# EAGLE design ATTINY85-USB (EAGLE 7.1.0)
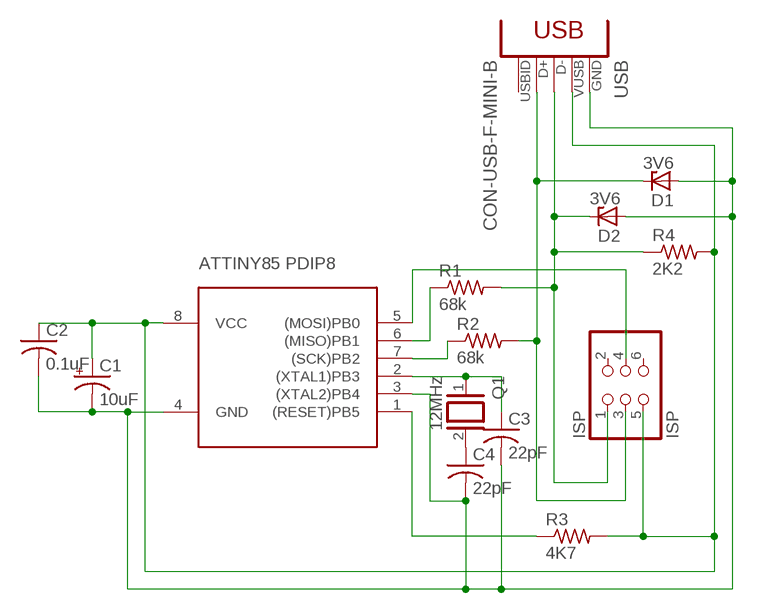
[diagram p0: schematic, sheet 1]

## Parts
C1  10uF  CPOL-USE2-4  [E2-4]
C2  0.1uF  C-US025-024X044  [C025-024X044]
C3  22pF  C-US025-024X044  [C025-024X044]
C4  22pF  C-US025-024X044  [C025-024X044]
D1  3V6  ZENER-DIODEDO34-7  [DO34Z7]
D2  3V6  ZENER-DIODEDO34-7  [DO34Z7]
IC1  TINY85  ATTINY85-PDIP8  [DIL08]
ISP  ISP  PINHD-2X3  [2X03]
Q1  12MHz  XTAL/S  [QS]
R1  68k  R-US_0207/9  [0207/9]
R2  68k  R-US_0207/9  [0207/9]
R3  4K7  R-US_0207/9  [0207/9]
R4  2K2  R-US_0207/9  [0207/9]
USB  CON-USB-F-MINI-B  [CONN_USB_MINI-B]

## Nets
N$1: IC1.6((MISO)PB1) R1.1
N$2: D2.C ISP.1 R1.2 R4.1 USB.D-
N$3: D1.C ISP.3 R2.2 USB.D+
N$4: IC1.5((MOSI)PB0) ISP.4
N$5: IC1.1((RESET)PB5) R3.1
N$6: C4.1 Q1.2
N$8: C3.1 IC1.2((XTAL1)PB3) Q1.1
N$9: C1.+ C2.1 IC1.8(VCC) ISP.5 R3.2 R4.2 USB.VUSB
N$10: IC1.7((SCK)PB2) R2.1
N$11: C1.- C2.2 C3.2 C4.2 D1.A D2.A IC1.3((XTAL2)PB4) IC1.4(GND) USB.GND
Unconnected: ISP.2 ISP.6 USB.BODY@1(BODY) USB.BODY@2(BODY) USB.BODY@3(BODY) USB.BODY@4(BODY) USB.ID(USBID)

## Library data of the parts
C1 = adafruit:CPOL-US: POLARIZED CAPACITOR, American symbol
C2-C4 = adafruit:C-US: CAPACITOR, American symbol
D1 D2 = diode:ZENER-DIODE: Z-Diode
IC1 = modal:ATTINY85-PDIP8
ISP = pinhead:PINHD-2X3: PIN HEADER
Q1 = special:XTAL/S: CRYSTAL
R1-R4 = adafruit:R-US_: RESISTOR, American symbol
USB = dp_devices:CON-USB-F: USB Female connector

## Board
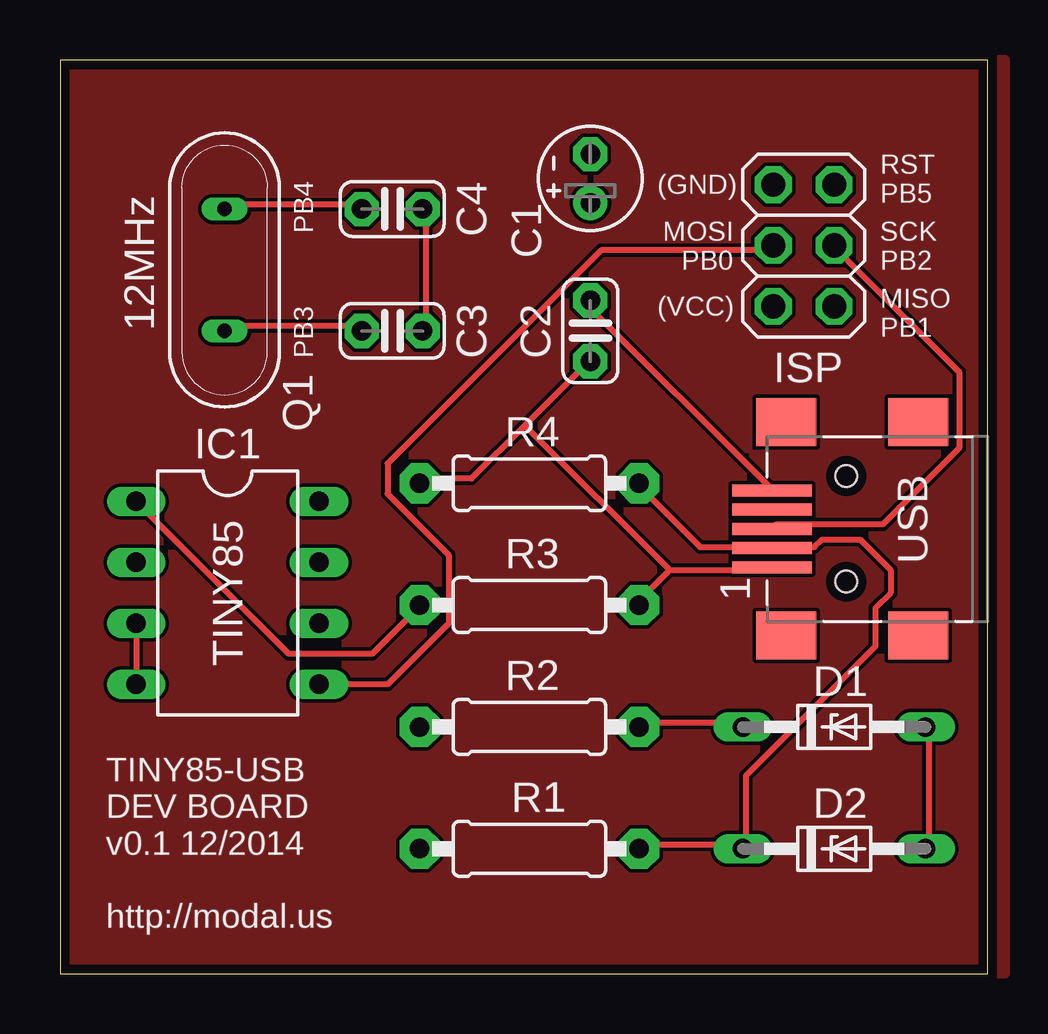
[diagram p1: board, top side]
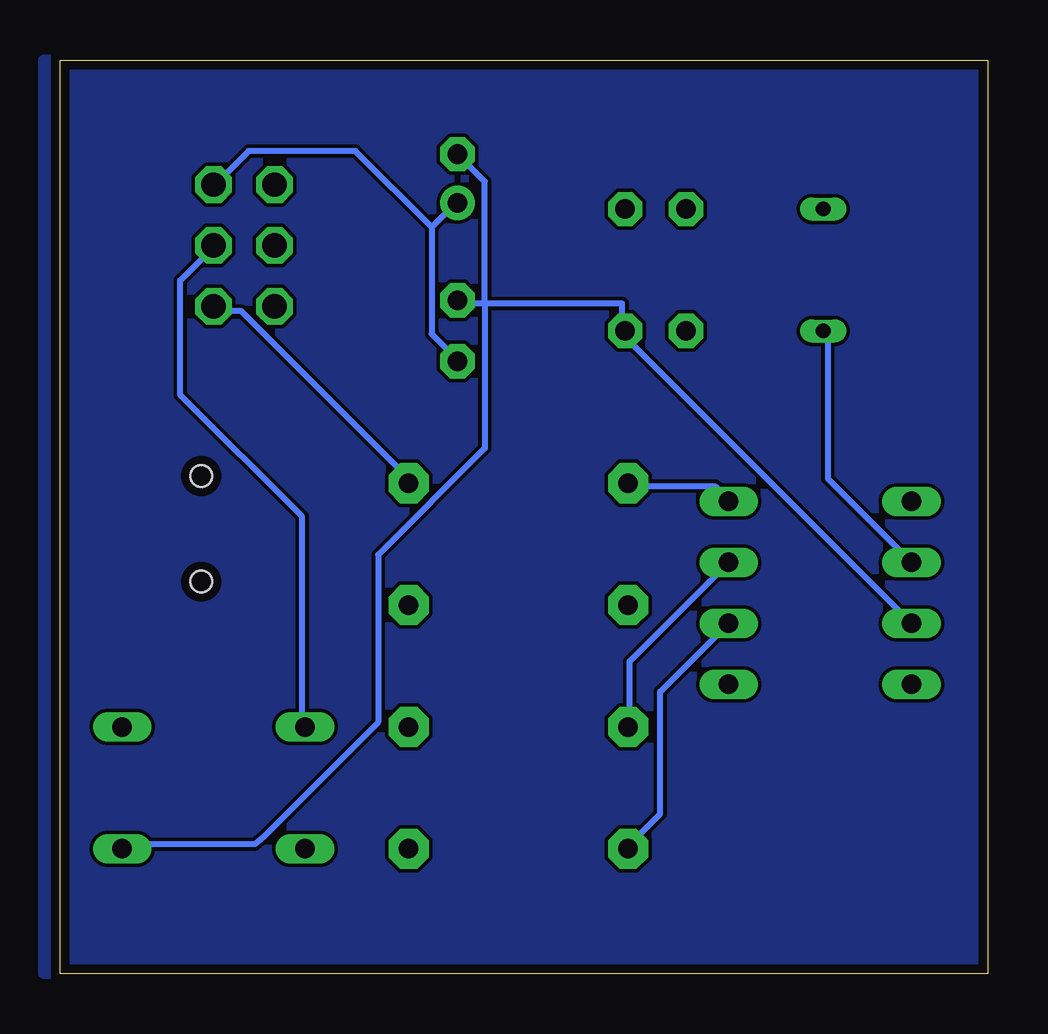
[diagram p2: board, bottom side, seen from below]

Size 38.66 x 38.09 mm. Coordinates in mm from the lower left corner, seen from the top.
Outline: 0,0 38.66,0 38.66,38.09 0,38.09 0,0
Copper layers (1*16): Top 0.0356mm / dielectric 1.5011mm / Bottom 0.0356mm
Design rules "LaenPCBOrder": minimum track width 6mil, minimum drill 13mil, track to track 6mil, track to pad 6mil, pad to pad 6mil, via to via 6mil, smd to smd 6mil, copper to edge 15mil, drill to drill 6mil, minimum pad ring 7mil, minimum via ring 7mil, stop-mask expansion 3mil, vias tented up to drill 0mil, thermal gap 10mil

### Footprints (pad centres in the part's own frame; a part is rotated, then mirrored left to right if it is on the bottom)
E2-4 = drill 0.813 pad 1.422: + -1.016,0 | drill 0.813 pad 1.422 octagon: - 1.016,0
C025-024X044 = drill 0.813 pad 1.422 octagon: 1 -1.27,0; 2 1.27,0
DO34Z7 = drill 0.813 long: A 3.81,0; C -3.81,0
DIL08 = drill 0.813 long: 1 -3.81,-3.81; 2 -1.27,-3.81; 3 1.27,-3.81; 4 3.81,-3.81; 5 3.81,3.81; 6 1.27,3.81; 7 -1.27,3.81; 8 -3.81,3.81
2X03 = drill 1.016 octagon: 1 -2.54,-1.27; 2 -2.54,1.27; 3 0,-1.27; 4 0,1.27; 5 2.54,-1.27; 6 2.54,1.27
QS = drill 0.61 long: 1 -2.54,0; 2 2.54,0
0207/9 = drill 0.813 pad 1.676 octagon: 1 -4.572,0; 2 4.572,0
CONN_USB_MINI-B = smd 2 x 2.5: BODY@1 -4.45,2.5; BODY@2 4.45,2.5; BODY@3 4.45,-3; BODY@4 -4.45,-3 | smd 0.5 x 3.3: D+ 0,3.1; D- -0.8,3.1; GND 1.6,3.1; ID 0.8,3.1; VUSB -1.6,3.1 | hole 0.9: -2.2,0; 2.2,0

### Placement (x,y rotation side)
C1  22.1,33.15 90 top
C2  22.1,26.8 90 top
C3  13.84,26.8 0 top
C4  13.84,31.88 0 top
D1  32.26,10.29 0 top
D2  32.26,5.21 0 top
IC1  6.99,15.88 270 top
ISP  30.99,30.35 90 top
Q1  6.86,29.34 90 top
R1  19.56,5.21 0 top
R2  19.56,10.29 0 top
R3  19.56,15.37 0 top
R4  19.56,20.45 180 top
USB  32.77,18.54 90 top

### Tracks (layer width: path | path; a pad name or v marks a point on that pad's centre or on a via)
N$1
  Bottom 0.254: IC1.6 13.65,11.75 13.65,6.67 14.92,5.4 R1.1
N$2
  Top 0.254: R1.2 24.13,5.4 28.26,5.4 D2.C 28.57,5.4 28.57,8.26 33.97,13.65 33.97,15.24 34.61,15.88 34.61,16.83 33.34,18.1 31.75,18.1 31.43,17.78 29.84,17.78 USB.D- 29.53,17.78 26.67,17.78 24.13,20.32 R4.1
  Bottom 0.254: ISP.1 32.07,27.62 31.11,27.62 24.13,20.64 R4.1
N$3
  Top 0.254: D1.C 28.26,10.48 24.13,10.48 R2.2 | USB.D+ 29.84,18.73 34.29,18.73 37.47,21.91 37.47,25.08 32.38,30.16 ISP.3
  Bottom 0.254: ISP.3 32.38,30.16 33.66,28.89 33.66,24.13 28.57,19.05 28.57,10.48 D1.C
N$4
  Top 0.254: IC1.5 13.65,12.06 16.19,14.61 16.19,17.46 13.65,20 13.65,21.27 22.54,30.16 29.53,30.16 ISP.4
N$5
  Top 0.254: IC1.1 9.53,13.34 13.02,13.34 14.92,15.24 R3.1
N$6
  Top 0.254: Q1.2 6.99,32.07 12.38,32.07 C4.1
N$7
  pour Top: 0,38.1 39.37,38.1 39.37,0 0,0 0,1.27
N$8
  Top 0.254: Q1.1 6.99,26.99 12.38,26.99 C3.1
  Bottom 0.254: IC1.2 6.67,20.64 6.67,26.67 Q1.1
N$9
  Top 0.254: 25.4,16.83 29.53,16.83 USB.VUSB | 25.4,16.83 24.13,15.56 R3.2 | 19.37,22.86 21.91,25.4 C2.1 | 19.37,22.86 17.14,20.64 15.24,20.64 R4.2 | 19.37,22.86 25.4,16.83
  Bottom 0.254: IC1.8 11.37,20.32 14.92,20.32 R4.2 | 23.18,31.11 23.18,26.67 22.23,25.72 C2.1 | 23.18,31.11 22.23,32.07 C1.+ | 23.18,31.11 26.35,34.29 30.8,34.29 32.07,33.02 ISP.5
N$10
  Bottom 0.254: IC1.7 14.92,13.02 14.92,10.48 R2.1
N$11
  Top 0.254: D2.A 36.2,5.4 36.2,10.16 D1.A | IC1.3 IC1.4 | C3.2 15.24,26.99 15.24,31.75 C4.2 | USB.GND 29.53,20.32 21.91,27.94 C2.2
  Bottom 0.254: 20.95,27.94 15.24,27.94 15.24,26.99 C3.2 14.92,26.67 14.92,26.35 IC1.3 | 20.95,27.94 21.91,27.94 C2.2 | C1.- 20.95,33.02 20.95,27.94 | 20.95,27.94 20.95,21.91 25.4,17.46 25.4,10.48 30.16,5.71 30.54,5.4 35.88,5.4 D2.A
N$12
  pour Bottom: 0,38.1 39.37,38.1 39.37,0 0,0

### Text on the board
tNames: (GND) | RST / PB5 | PB4 | MOSI / PB0 | SCK / PB2 | (VCC) | MISO / PB1 | PB3 | TINY85-USB / DEV BOARD / v0.1 12/2014 / / http://modal.us